# EAGLE design ir_remote_smd (EAGLE 8.3.2)
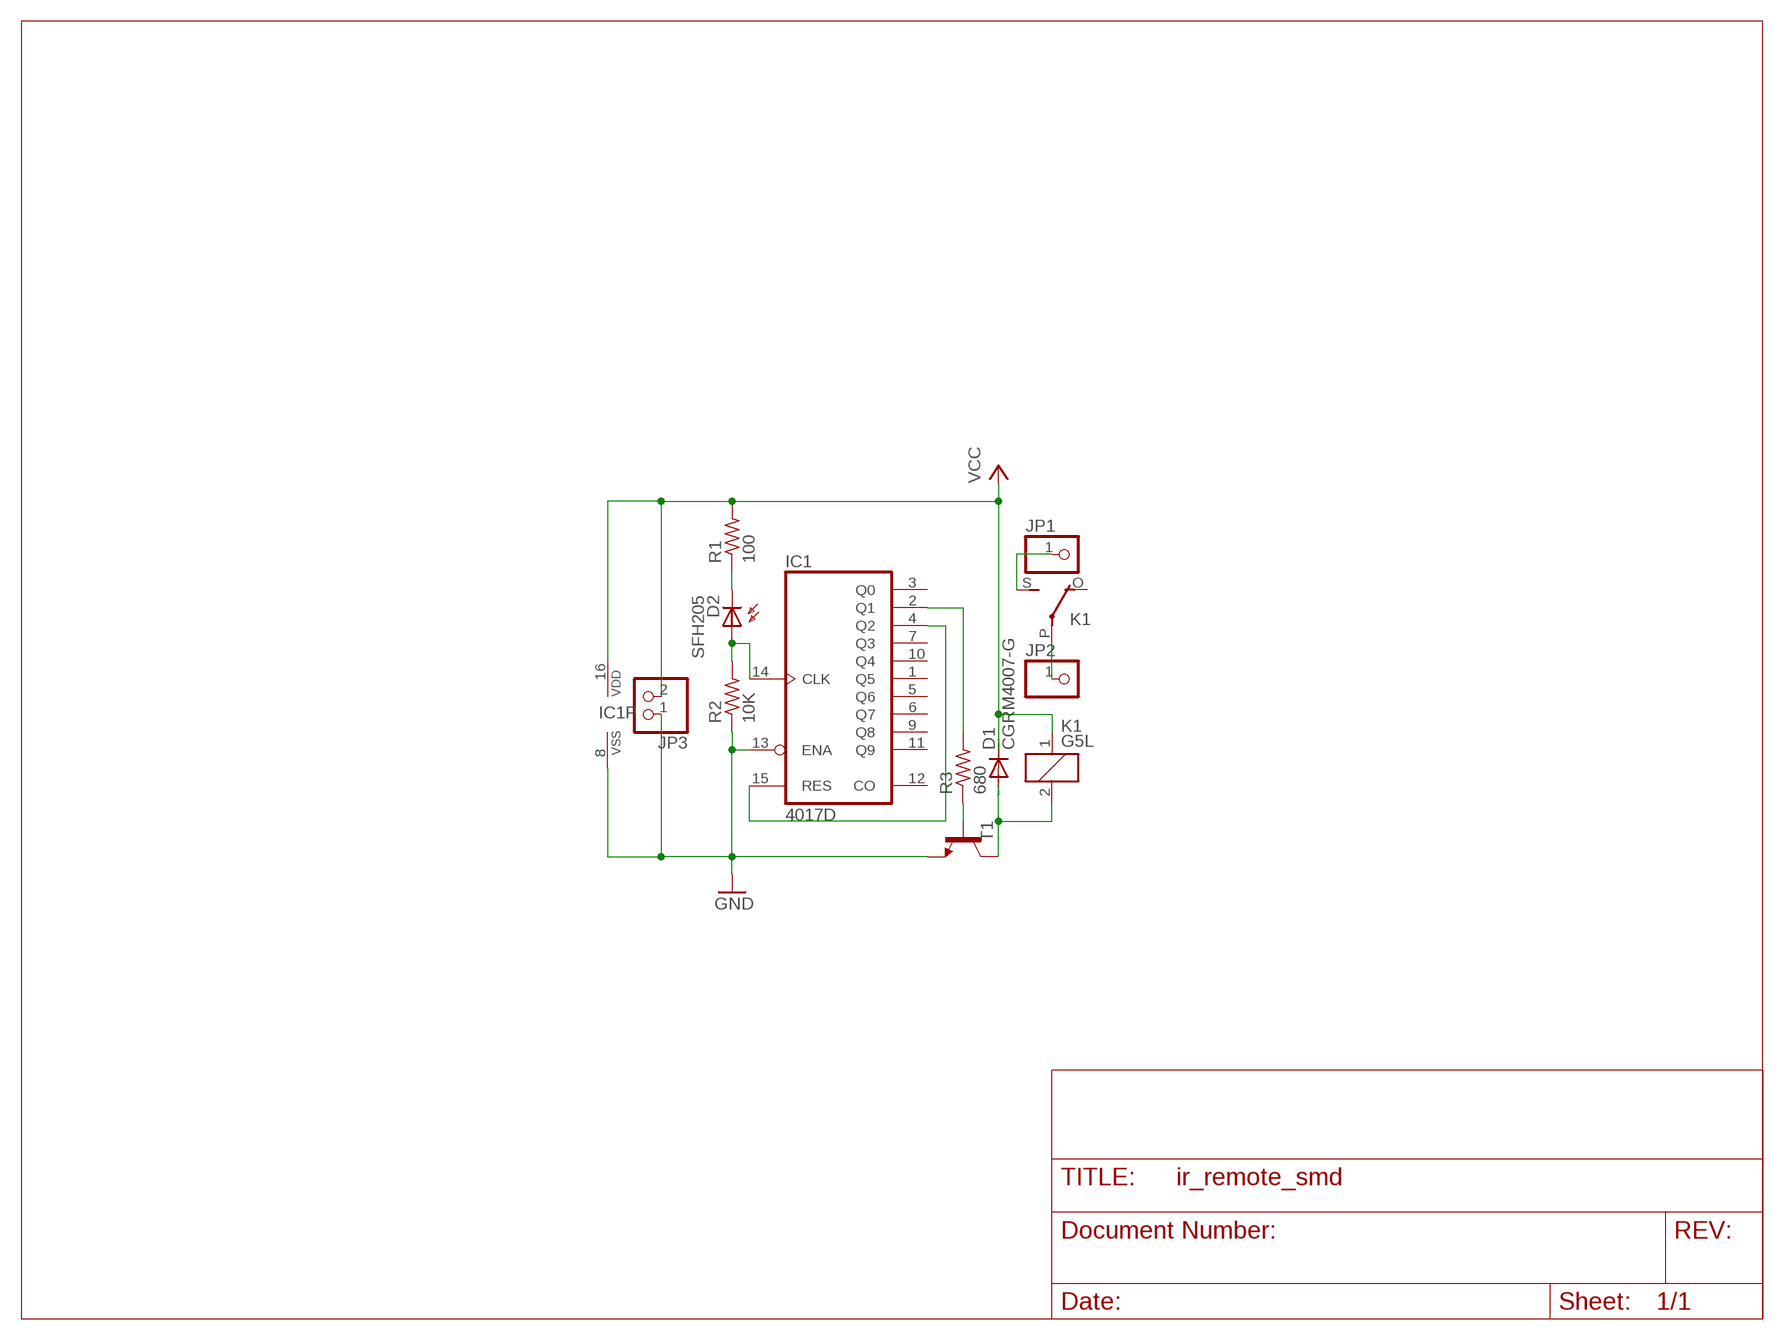
[diagram p0: schematic, sheet 1]

## Parts
D1  CGRM4007-G  [SOD-123_MINI-SMA]
D2  SFH205  [SFH205]
IC1  4017D  [SO16]
JP1  PINHD-1X1  [1X01]
JP2  PINHD-1X1  [1X01]
JP3  PINHD-1X2  [1X02]
K1  G5L  [G5LE]
R1  100  R-US_R0603  [R0603]
R2  10K  R-US_R0603  [R0603]
R3  680  R-US_R0603  [R0603]
T1  MMBT2222ALT1-NPN-SOT23-BEC  [SOT23-BEC]

## Nets
GND: IC1.8(VSS) IC1.13(ENA) JP3.1 R2.1 T1.E
N$1: IC1.4(Q2) IC1.15(RES)
N$2: IC1.2(Q1) R3.2
N$3: R3.1 T1.B
N$5: D2.A IC1.14(CLK) R2.2
N$6: D2.K(C) R1.1
PWR_IN: JP2.1 K1.P(2:P)
PWR_OUT: JP1.1 K1.S(2:S)
REL_SIG: D1.A K1.2 T1.C
VCC: D1.C IC1.16(VDD) JP3.2 K1.1 R1.2
Unconnected: IC1.1(Q5) IC1.3(Q0) IC1.5(Q6) IC1.6(Q7) IC1.7(Q3) IC1.9(Q8) IC1.10(Q4) IC1.11(Q9) IC1.12(CO) K1.O(2:O)

## Library data of the parts
D1 = diode:CGRM400*-G: Molded plasitc,JEDEC SOD-123/Mini SMA Source: Comchip CGRM4001-G.pdf
D2 = opto-trans-siemens:SFH205: PHOTO DIODE; OC_FARNELL: unknown; OC_NEWARK: unknown
IC1 = 40xx:4017: COUNTER/DIVIDER
JP1 JP2 = pinhead:PINHD-1X1: PIN HEADER
JP3 = pinhead:PINHD-1X2: PIN HEADER
K1 = relay:G5L: RELAY 1 x switch, 10 A/120 V AC, 8 A/30 V ADC, Omron; OC_FARNELL: unknown; OC_NEWARK: unknown
R1-R3 = resistor:R-US_: RESISTOR, American symbol
T1 = transistor:*-NPN-: NPN Transistror BF959 corrected 2008.03.06

## Board
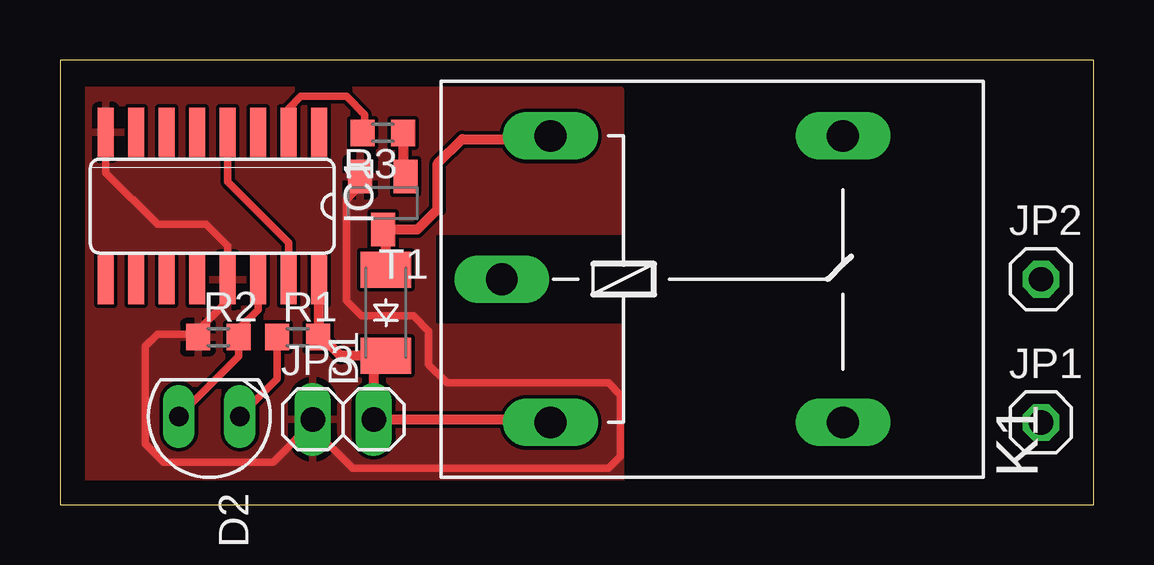
[diagram p1: board, top side]
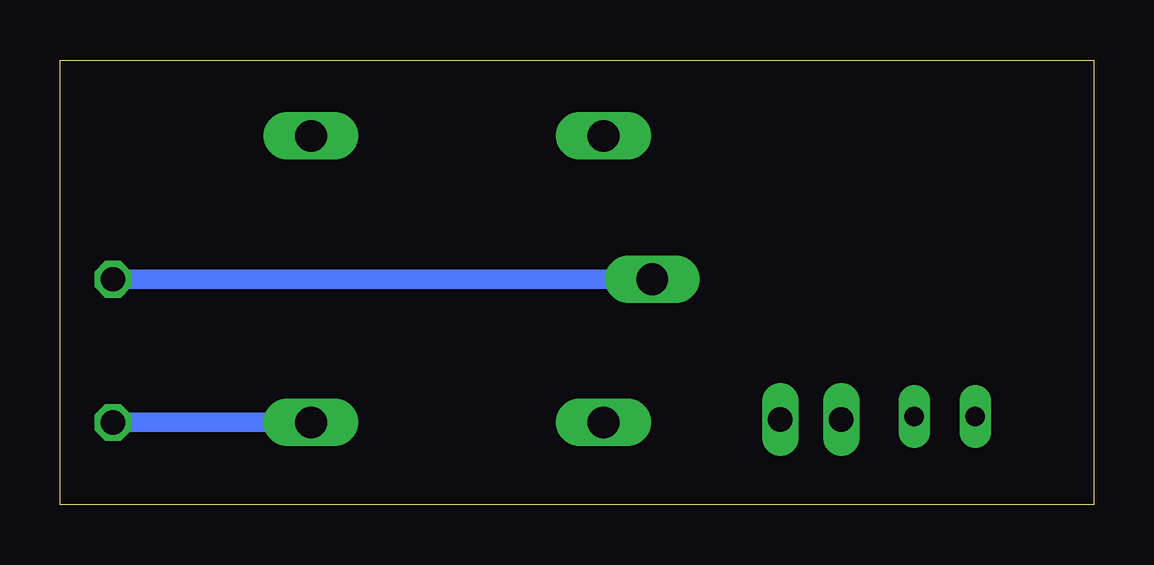
[diagram p2: board, bottom side, seen from below]

Size 43.1 x 18.53 mm. Coordinates in mm from the lower left corner, seen from the top.
Outline: 0,0 43.1,0 43.1,18.53 0,18.53 0,0
Copper layers (1*16): Top 0.035mm / dielectric 1.5mm / Bottom 0.035mm
Design rules "default": minimum track width 6mil, minimum drill 0.35mm, track to track 6mil, track to pad 6mil, pad to pad 6mil, via to via 6mil, smd to smd 6mil, copper to edge 40mil, drill to drill 6mil, minimum pad ring 10mil, minimum via ring 8mil, stop-mask expansion 4mil, vias tented up to drill 0mil, thermal gap 10mil

### Footprints (pad centres in the part's own frame; a part is rotated, then mirrored left to right if it is on the bottom)
SOD-123_MINI-SMA = smd 1.5 x 2.1: A 1.8,0; C -1.8,0
SFH205 = drill 0.813 long: A 0,-1.27; K 0,1.27
SO16 = smd 0.66 x 2.032: 1 -4.445,-3.073; 2 -3.175,-3.073; 3 -1.905,-3.073; 4 -0.635,-3.073; 5 0.635,-3.073; 6 1.905,-3.073; 7 3.175,-3.073; 8 4.445,-3.073; 9 4.445,3.073; 10 3.175,3.073; 11 1.905,3.073; 12 0.635,3.073; 13 -0.635,3.073; 14 -1.905,3.073; 15 -3.175,3.073; 16 -4.445,3.073
1X01 = drill 1.016 octagon: 1 0,0
1X02 = drill 1.016 long: 1 -1.27,0; 2 1.27,0
G5LE = drill 1.321 long: 1 -7.493,-5.969; 2 -7.493,5.969; O 4.699,5.969; P -9.525,0; S 4.699,-5.969
R0603 = smd 1 x 1.1: 1 -0.85,0; 2 0.85,0
SOT23-BEC = smd 1 x 1.4: B -0.95,-1.1; C 0,1.1; E 0.95,-1.1

### Placement (x,y rotation side)
D1  13.59,8 90 top
D2  6.22,3.68 270 top
IC1  6.35,12.45 180 top
JP1  40.89,3.43 0 top
JP2  40.89,9.4 0 top
JP3  11.81,3.56 0 top
K1  27.94,9.4 0 top
R1  9.91,6.99 0 top
R2  6.6,6.99 0 top
R3  13.46,15.49 180 top
T1  13.46,12.57 180 top

### Tracks (layer width: path | path; a pad name or v marks a point on that pad's centre or on a via)
GND
  Top 0.305: 7.11,9.14 7.11,8.64 5.75,7.28 R2.1 5.63,7.11 4.06,7.11 3.56,6.6 3.56,2.54 4.32,1.78 8.89,1.78 10.54,3.43 JP3.1 10.54,3.18 12.19,1.52 22.86,1.52 23.37,2.03 23.37,4.57 22.86,5.08 16.13,5.08 15.37,5.84 15.37,7.24 14.73,7.87 12.57,7.87 11.94,8.51 11.94,12.7 12.51,13.27 T1.E | 7.11,9.14 7.11,9.25 IC1.13 | IC1.8 1.91,13.84 4.06,11.68 6.1,11.68 6.98,10.79 6.98,9.27 7.11,9.14
  pour Top: 23.37,1.02 23.37,17.27 1.02,17.27 1.02,1.02
N$1
  Top 0.305: IC1.15 9.52,10.92 6.98,13.46 IC1.4
N$2
  Top 0.305: IC1.2 9.52,16.51 10.03,17.02 11.94,17.02 12.7,16.26 12.7,15.58 R3.2
N$3
  Top 0.406: R3.1 14.31,13.77 T1.B
N$5
  Top 0.305: D2.A 7.45,6.18 R2.2 7.45,7.33 8.26,8.13 IC1.14
N$6
  Top 0.305: R1.1 9.06,5.25 D2.K
PWR_IN
  Bottom 0.813: K1.P JP2.1
PWR_OUT
  Bottom 0.813: K1.S JP1.1
REL_SIG
  Top 0.406: D1.A 13.59,11.35 T1.C 14.9,11.47 15.75,12.32 15.75,14.22 16.76,15.24 20.32,15.24 K1.2
RESTRICTED
  cutout Top: 15.75,7.62 15.75,11.18 23.37,11.18 23.37,7.62
VCC
  Top 0.406: 10.8,7.11 IC1.16 | 10.8,7.11 10.8,7.02 R1.2 | 13.21,6.2 D1.C | 13.21,6.2 11.71,6.2 10.8,7.11 | 13.21,6.2 13.08,6.07 JP3.2 20.32,3.56 K1.1